# EAGLE schematic Tom Casey (EAGLE 7.1.0)
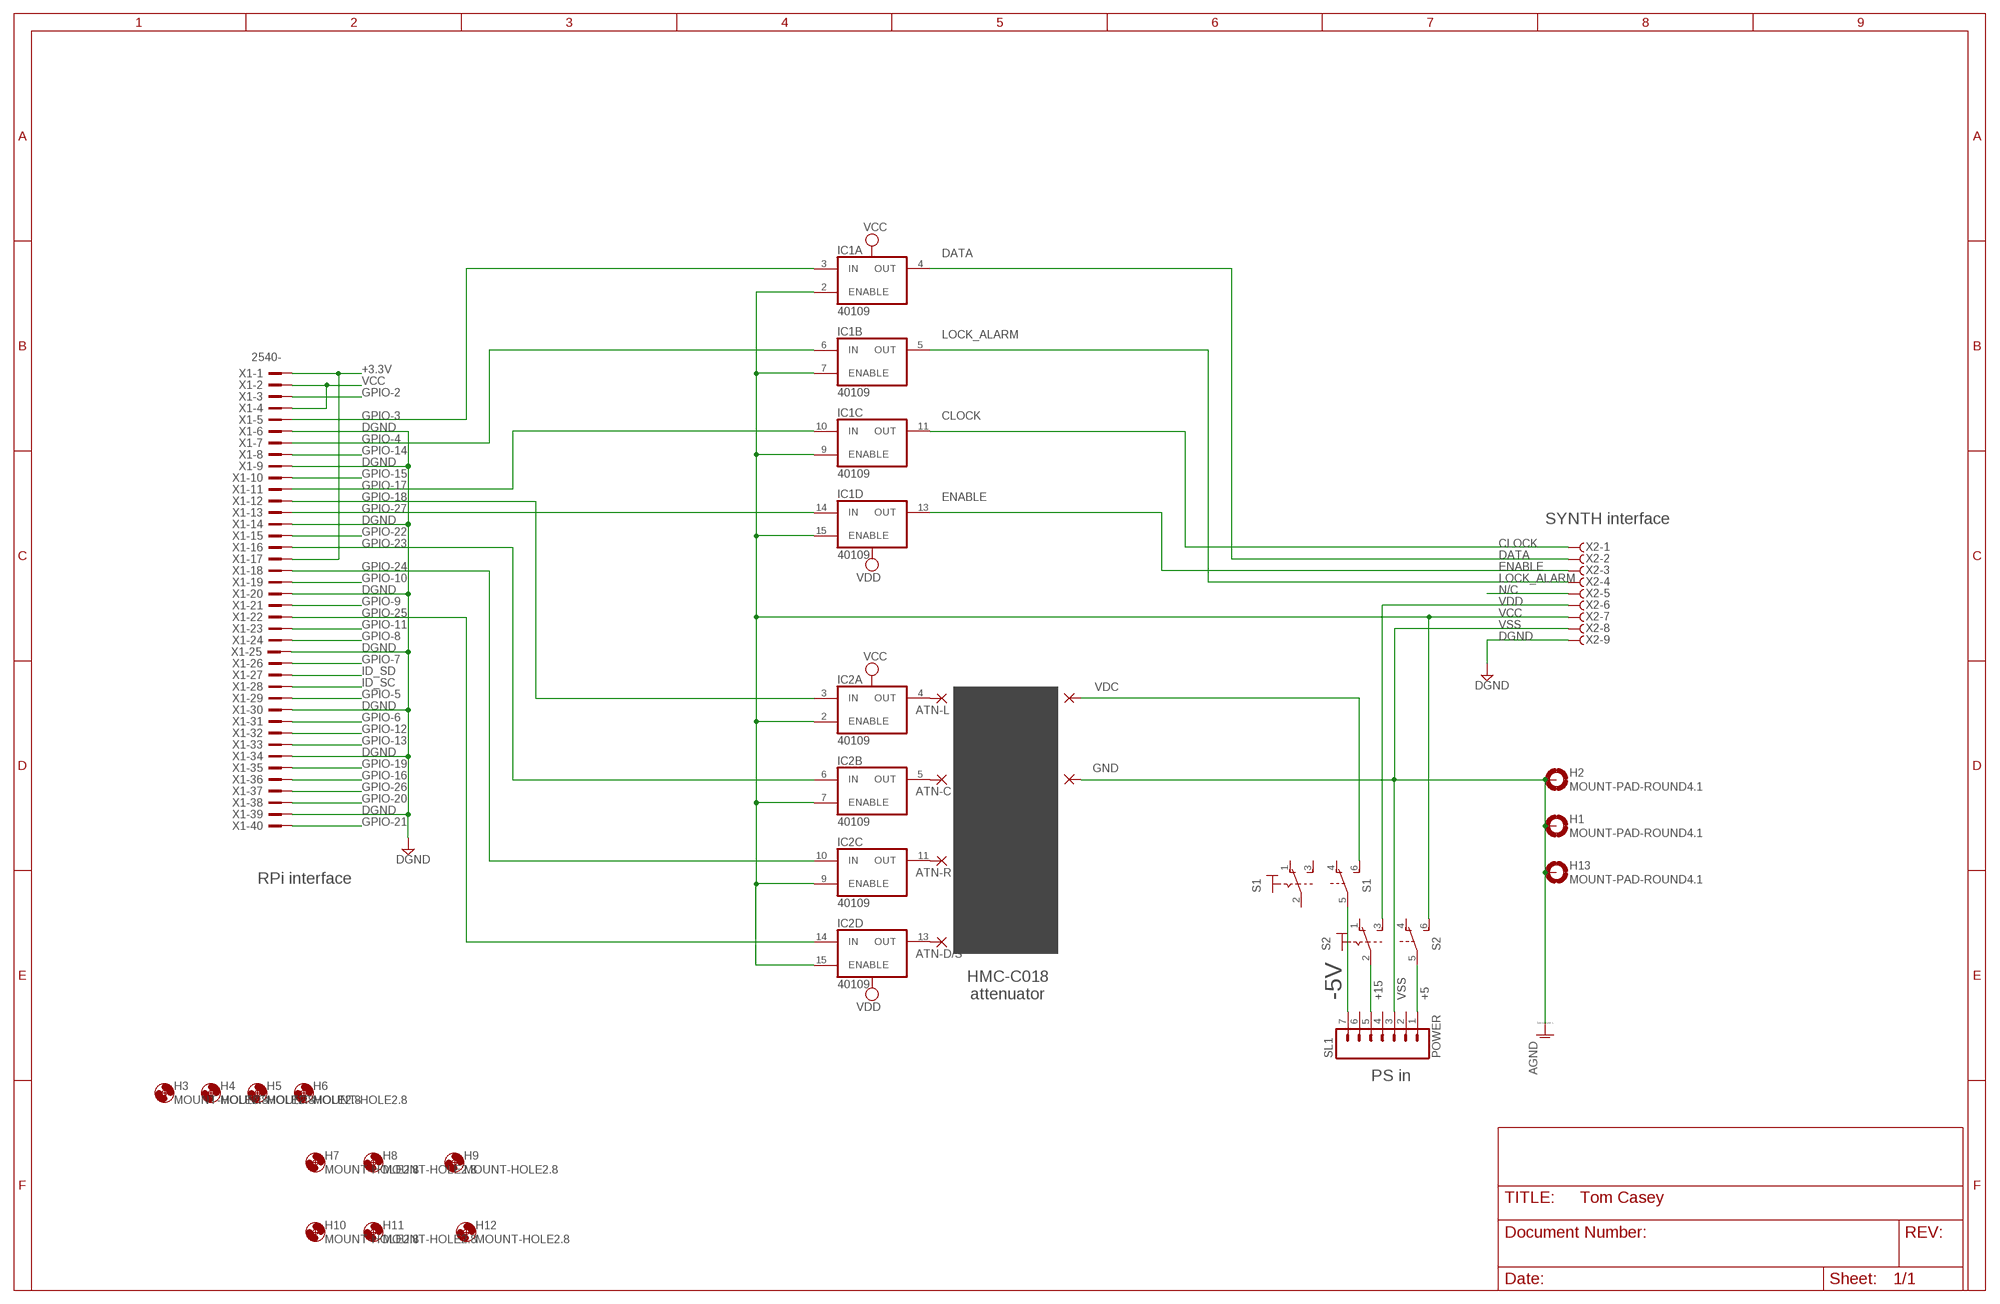
[diagram p0: schematic, sheet 1]

## Parts
ATN-C  PAD-0400  [0400]
ATN-D/S  PAD-0400  [0400]
ATN-L  PAD-0400  [0400]
ATN-R  PAD-0400  [0400]
GND  PAD-0400  [0400]
H1  MOUNT-PAD-ROUND4.1  [4,1-PAD]
H2  MOUNT-PAD-ROUND4.1  [4,1-PAD]
H3  MOUNT-HOLE2.8  [2,8]
H4  MOUNT-HOLE2.8  [2,8]
H5  MOUNT-HOLE2.8  [2,8]
H6  MOUNT-HOLE2.8  [2,8]
H7  MOUNT-HOLE2.8  [2,8]
H8  MOUNT-HOLE2.8  [2,8]
H9  MOUNT-HOLE2.8  [2,8]
H10  MOUNT-HOLE2.8  [2,8]
H11  MOUNT-HOLE2.8  [2,8]
H12  MOUNT-HOLE2.8  [2,8]
H13  MOUNT-PAD-ROUND4.1  [4,1-PAD]
IC1  40109  [DIL16]
IC2  40109  [DIL16]
S1  M9040P2  [M9040P2]
S2  M9040P2  [M9040P2]
SL1  POWER  M07  [07P]
VDC  PAD-0400  [0400]
X1  2540-  [PAK100/2500-40]
X2  F09HPS  [F09HP]

## Nets
+3.3V: X1.1 X1.17
+5: S2.5(2:P) SL1.1
+15: S2.2(1:P) SL1.5
-5V: S1.5(2:P) SL1.7
CLOCK: IC1.11(C:OUT) X2.1
DATA: IC1.4(A:OUT) X2.2
DGND: X1.6 X1.9 X1.14 X1.20 X1.25 X1.30 X1.34 X1.39 X2.9
ENABLE: IC1.13(D:OUT) X2.3
GPIO-2: X1.3
GPIO-3: IC1.3(A:IN) X1.5
GPIO-4: IC1.6(B:IN) X1.7
GPIO-5: X1.29
GPIO-6: X1.31
GPIO-7: X1.26
GPIO-8: X1.24
GPIO-9: X1.21
GPIO-10: X1.19
GPIO-11: X1.23
GPIO-12: X1.32
GPIO-13: X1.33
GPIO-14: X1.8
GPIO-15: X1.10
GPIO-16: X1.36
GPIO-17: IC1.10(C:IN) X1.11
GPIO-18: IC2.3(A:IN) X1.12
GPIO-19: X1.35
GPIO-20: X1.38
GPIO-21: X1.40
GPIO-22: X1.15
GPIO-23: IC2.6(B:IN) X1.16
GPIO-24: IC2.10(C:IN) X1.18
GPIO-25: IC2.14(D:IN) X1.22
GPIO-26: X1.37
GPIO-27: IC1.14(D:IN) X1.13
ID_SC: X1.28
ID_SD: X1.27
LOCK_ALARM: IC1.5(B:OUT) X2.4
N$9: ATN-L.P$1(P) IC2.4(A:OUT)
N$10: ATN-C.P$1(P) IC2.5(B:OUT)
N$11: ATN-R.P$1(P) IC2.11(C:OUT)
N$12: ATN-D/S.P$1(P) IC2.13(D:OUT)
N$14: S1.6(2:S) VDC.P$1(P)
N/C: X2.5
VCC: IC1.2(A:ENABLE) IC1.7(B:ENABLE) IC1.9(C:ENABLE) IC1.15(D:ENABLE) IC2.2(A:ENABLE) IC2.7(B:ENABLE) IC2.9(C:ENABLE) IC2.15(D:ENABLE) S2.6(2:S) X1.2 X1.4 X2.7
VDD: S2.3(1:S) X2.6
VSS: GND.P$1(P) H1.B4,1(MOUNT) H2.B4,1(MOUNT) H13.B4,1(MOUNT) SL1.3 X2.8 ; supply symbol labelled AGND
Unconnected: S1.1(1:O) S1.2(1:P) S1.3(1:S) S1.4(2:O) S2.1(1:O) S2.4(2:O) SL1.2 SL1.4 SL1.6

## Notes on the sheet
- SYNTH interface
- RPi interface
- HMC-C018
  attenuator
- PS in

## Power pins joined to a net without a drawn wire
VCC: IC1.1(P:VCC) IC2.1(P:VCC)
VDD: IC1.16(P:VDD) IC2.16(P:VDD)
VSS: IC1.8(P:VSS) IC2.8(P:VSS)

## Library data of the parts
ATN-C ATN-D/S ATN-L ATN-R GND VDC = dpads:PAD: WIRE PAD Standard US Drill Sizes and SMD pads
H1 H2 H13 = holes:MOUNT-PAD-ROUND: MOUNTING PAD, round
H3-H12 = holes:MOUNT-HOLE: MOUNTING HOLE with drill center marker
IC1 IC2 = 40xx-2:40109
S1 S2 = switch:M9040P2: TOGGLE SWITCH Marquardt
SL1 = con-amp-quick:M07: AMP QUICK CONNECTOR; OC_FARNELL: unknown; OC_NEWARK: unknown
X1 = con-3m:2540-: 3M (TM) Pak 100 4-Wall Header Source: 3M; OC_FARNELL: unknown; OC_NEWARK: unknown
X2 = con-subd:F09?S: SUB-D; OC_FARNELL: unknown; OC_NEWARK: unknown